# Altium schematic sheet LTE+GPS.SchDoc
size 420 x 297 mm
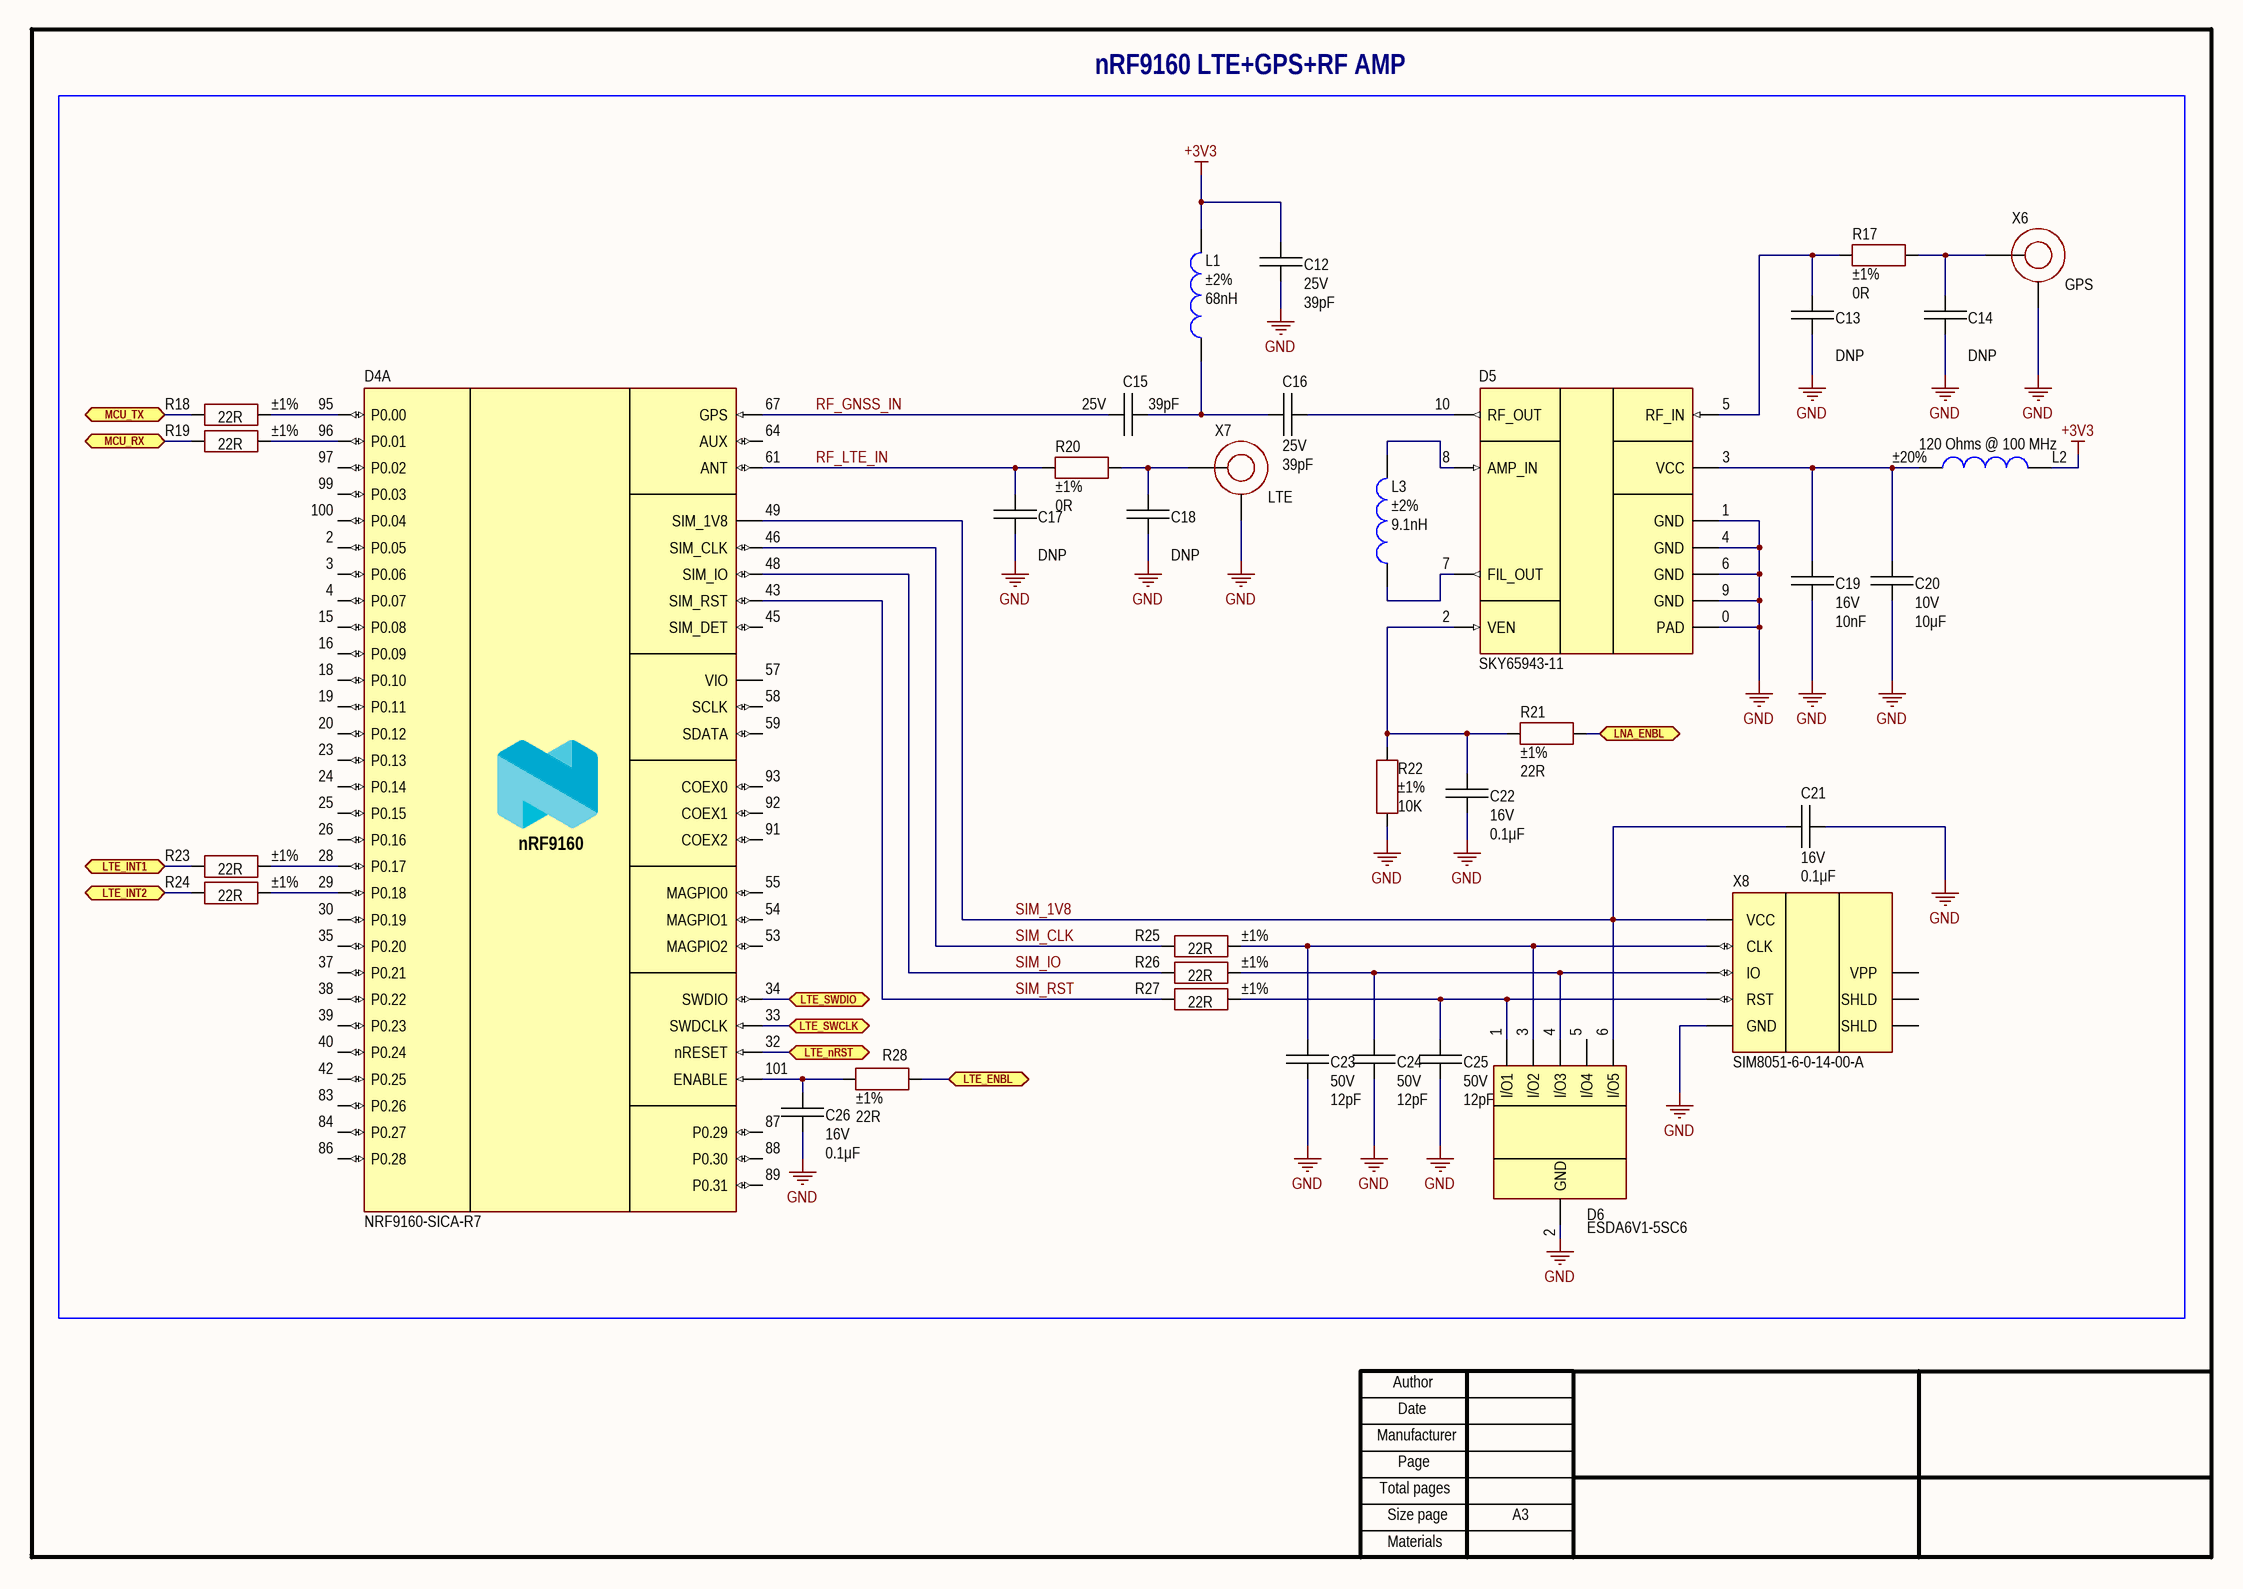
[diagram p0: LTE+GPS.SchDoc]

## Parts
C12  value 39pF  Voltage: 25V  [CAP: 0201]
C13  value DNP  [CAP: 0201]
C14  value DNP  [CAP: 0201]
C15  value 39pF  Voltage: 25V  [CAP: 0201]
C16  value 39pF  Voltage: 25V  [CAP: 0201]
C17  value DNP  [CAP: 0201]
C18  value DNP  [CAP: 0201]
C19  value 10nF  Voltage: 16V  [CAP: 0402_NO_SILK]
C20  value 10μF  Voltage: 10V  [CAP: 0805]
C21  value 0.1μF  Voltage: 16V  [CAP: 0402_NO_SILK]
C22  value 0.1μF  Voltage: 16V  [CAP: 0805]
C23  value 12pF  Voltage: 50V  [CAP: 0805]
C24  value 12pF  Voltage: 50V  [CAP: 0805]
C25  value 12pF  Voltage: 50V  [CAP: 0805]
C26  value 0.1μF  Voltage: 16V  [CAP: 0805]
D4  PartNumber: NRF9160-SICA-R7  [MOD: NRF9160]  (part A of 3)
D5  (no value)  [IC: SKY65943-11]
D6  (no value)  [SOT23-6]
L1  value 68nH  Tolerance: ±2%  [IND: 0402]
L2  value 120 Ohms @ 100 MHz  Tolerance: ±20%  [IND: 0805]
L3  value 9.1nH  Tolerance: ±2%  [IND: 0402]
R17  value 0R  Tolerance: ±1%  [RES: 0201]
R18  value 22R  Tolerance: ±1%  [RES: 0805]
R19  value 22R  Tolerance: ±1%  [RES: 0805]
R20  value 0R  Tolerance: ±1%  [RES: 0201]
R21  value 22R  Tolerance: ±1%  [RES: 0805]
R22  value 10K  Tolerance: ±1%  [RES: 0805]
R23  value 22R  Tolerance: ±1%  [RES: 0805]
R24  value 22R  Tolerance: ±1%  [RES: 0805]
R25  value 22R  Tolerance: ±1%  [RES: 0805]
R26  value 22R  Tolerance: ±1%  [RES: 0805]
R27  value 22R  Tolerance: ±1%  [RES: 0805]
R28  value 22R  Tolerance: ±1%  [RES: 0805]
X6  CommentText: GPS  [CON: u.Fl]
X7  CommentText: LTE  [CON: u.Fl]
X8  (no value)  [CON: SIM8051-6-0-14-00]

## Blocks framed on the sheet
nRF9160 LTE+GPS+RF AMP: C12-C26 D4-D6 L1-L3 R17-R28 X6-X8

## Ports
LNA_ENBL (bidir), LTE_ENBL (bidir), LTE_INT1 (bidir), LTE_INT2 (bidir), LTE_nRST (bidir), LTE_SWCLK (bidir), LTE_SWDIO (bidir), MCU_RX (bidir), MCU_TX (bidir)

## Nets
+3V3: C12.1 L1.1 L2.1
GND: C12.2 C13.1 C14.1 C17.1 C18.1 C19.1 C20.1 C21.2 C22.1 C23.1 C24.1 C25.1 C26.1 D5.0(PAD) D5.1(GND) D5.4(GND) D5.6(GND) D5.9(GND) D6.2(GND) R22.1 X6.2 X7.2 X8.C5(GND)
LNA_ENBL: R21.1 ; port LNA_ENBL
LTE_ENBL: R28.1 ; port LTE_ENBL
LTE_INT1: R23.1 ; port LTE_INT1
LTE_INT2: R24.1 ; port LTE_INT2
LTE_nRST: D4.32(nRESET) ; port LTE_nRST
LTE_SWCLK: D4.33(SWDCLK) ; port LTE_SWCLK
LTE_SWDIO: D4.34(SWDIO) ; port LTE_SWDIO
MCU_RX: R19.1 ; port MCU_RX
MCU_TX: R18.1 ; port MCU_TX
RF_GNSS_IN: C15.2 D4.67(GPS)
RF_LTE_IN: C17.2 D4.61(ANT) R20.2
SIM_1V8: C21.1 D4.49(SIM_1V8) D6.6(I/O5) X8.C1(VCC)
SIM_CLK: D4.46(SIM_CLK) R25.1
SIM_IO: D4.48(SIM_IO) R26.1
SIM_RST: D4.43(SIM_RST) R27.1
NetC13_2: C13.2 D5.5(RF_IN) R17.2
NetC14_2: C14.2 R17.1 X6.1
NetC15_1: C15.1 C16.2 L1.2
NetC16_1: C16.1 D5.10(RF_OUT)
NetC18_2: C18.2 R20.1 X7.1
NetC19_2: C19.2 C20.2 D5.3(VCC) L2.2
NetC22_2: C22.2 D5.2(VEN) R21.2 R22.2
NetC23_2: C23.2 D6.3(I/O2) R25.2 X8.C3(CLK)
NetC24_2: C24.2 D6.4(I/O3) R26.2 X8.C7(IO)
NetC25_2: C25.2 D6.1(I/O1) R27.2 X8.C2(RST)
NetC26_2: C26.2 D4.101(ENABLE) R28.2
NetD4_28: D4.28(P0.17) R23.2
NetD4_29: D4.29(P0.18) R24.2
NetD4_95: D4.95(P0.00) R18.2
NetD4_96: D4.96(P0.01) R19.2
NetD5_7: D5.7(FIL_OUT) L3.2
NetD5_8: D5.8(AMP_IN) L3.1

Not connected (* = marked no-connect by the designer): D4 2(P0.05) 3(P0.06) 4(P0.07) 15(P0.08) 16(P0.09) 18(P0.10) 19(P0.11) 20(P0.12) 23(P0.13) 24(P0.14) 25(P0.15) 26(P0.16) 30(P0.19) 35(P0.20) 37(P0.21) 38(P0.22) 39(P0.23) 40(P0.24) 42(P0.25) 45(SIM_DET) 53(MAGPIO2) 54(MAGPIO1) 55(MAGPIO0) 57(VIO) 58(SCLK) 59(SDATA) 64(AUX) 83(P0.26) 84(P0.27) 86(P0.28) 87(P0.29) 88(P0.30) 89(P0.31) 91(COEX2) 92(COEX1) 93(COEX0) 97(P0.02) 99(P0.03) 100(P0.04); D6 5(I/O4); X8 C4(SHLD) C6(VPP) C8(SHLD)

## Notes on the sheet
- Author
- Manufacturer
- Date
- Page
- Total pages
- Size page
- A3
- Materials

## Library data of the parts
C12 C15 C16 = Ceramic_0201: 39 pF ±5% 25V Ceramic Capacitor C0G, NP0 0201 (0603 Metric); Manufacturer: Murata Electronics; PartNumber: GRM0335C1E390JA01D; ValueManufacturerPartNumber: Ceramic capacitor, 39pF, NP0, ±5%, 25V, 0201, -55...+125°C; Package: 0201; HelpURL: https://www.digikey.com/en/products/detail/murata-electronics/GRM0335C1E390JA01D/4358216; Temperature: -55...+125°C; TypeCapacitor: Ceramic capacitor; Tolerance: ±5%; TypeDielectric: NP0
C13 C14 C17 C18 = Ceramic_0201: DNP; ValueManufacturerPartNumber: Ceramic capacitor, DNP, , , , 0201, -55...+125°C; TypeCapacitor: Ceramic capacitor; Package: 0201; Temperature: -55...+125°C
C19 = Ceramic_0402: 0.1 µF ±10% 16V Ceramic Capacitor X7R 0402 (1005 Metric); Manufacturer: Yageo; PartNumber: CC0805JKNPO7BN103; ValueManufacturerPartNumber: Ceramic capacitor, 10nF, X7R, ±10%, 16V, 0402, -55...+125°C; Package: 0402; HelpURL: https://www.digikey.com/en/products/detail/yageo/CC0805JKNPO7BN103/5884010; Temperature: -55...+125°C; TypeCapacitor: Ceramic capacitor; Tolerance: ±10%; TypeDielectric: X7R
C20 = Ceramic_0805: 10 µF ±10% 10V Ceramic Capacitor X7R 0805 (2012 Metric); Manufacturer: Yageo; PartNumber: CC0805KFX7R6BB106; ValueManufacturerPartNumber: Ceramic capacitor, 10μF, X7R, ±10%, 10V, 0805, -55...+125°C; Package: 0805; HelpURL: https://www.digikey.com/en/products/detail/yageo/CC0805KFX7R6BB106/11611326; Temperature: -55...+125°C; TypeCapacitor: Ceramic capacitor; Tolerance: ±10%; TypeDielectric: X7R
C21 = Ceramic_0402: 0.1 µF ±10% 16V Ceramic Capacitor X7R 0402 (1005 Metric); Manufacturer: Yageo; PartNumber: CC0402KRX7R7BB104; ValueManufacturerPartNumber: Ceramic capacitor, 0.1μF, X7R, ±10%, 16V, 0402, -55...+125°C; Package: 0402; HelpURL: https://www.digikey.com/product-detail/en/yageo/CC0402KRX7R7BB104/311-1338-1-ND/2103122; Temperature: -55...+125°C; TypeCapacitor: Ceramic capacitor; Tolerance: ±10%; TypeDielectric: X7R
C22 C26 = Ceramic_0805: Manufacturer: Yageo; PartNumber: CC0805KRX7R7BB104; ValueManufacturerPartNumber: Ceramic capacitor, 0.1μF, X7R, ±10%, 16V, 0805, -55...+125°C; TypeCapacitor: Ceramic capacitor; Tolerance: ±10%; TypeDielectric: X7R; Package: 0805; HelpURL: https://www.digikey.com/product-detail/en/yageo/CC0805KRX7R7BB104/311-1142-1-ND/303052; Temperature: -55...+125°C
C23-C25 = Ceramic_0805: 12 pF ±1% 50V Ceramic Capacitor C0G, NP0 0805 (2012 Metric); Manufacturer: Yageo; PartNumber: CC0805FRNPO9BN120; ValueManufacturerPartNumber: Ceramic capacitor, 12pF, NP0, ±10%, 50V, 0805, -55...+125°C; Tolerance: ±10%; Package: 0805; HelpURL: https://www.digikey.com/en/products/detail/yageo/CC0805FRNPO9BN120/5883925; Temperature: -55...+125°C; TypeCapacitor: Ceramic capacitor; TypeDielectric: NP0
D4 = nRF9160: LTE/GSM module; Manufacturer: Nordic Semiconductor; Supply: 3...5.5V; Frequency: 2.4GHz; TypeProtocol: LTE-M/NB-IoT/GPS; HelpURL: https://www.digikey.com/en/products/detail/nordic-semiconductor-asa/NRF9160-SICA-R7/10242085; Package: 127-LGA; ComponentType: LTE/GSM module; ValueManufacturerPartNumber: =ComponentType+', '+TypeProtocol+', '+Frequency+', '+CoreSize+', '+CoreProcessor+', '+MemoryROM+', '+MemoryRAM+', '+Supply+', '+Temperature+', '+Package; Temperature: -40...+85°C
D5 = SKY65943-11: RF front-end; Manufacturer: Skyworks Solutions; ValueManufacturerPartNumber: IC RF amplifier, 2.7 GHz, 19dB, -40...+125°C, 10-SMD Module; Gain: 19dB; Frequency: 2.7 GHz; HelpURL: https://www.digikey.com/en/products/detail/skyworks-solutions-inc/SKY65943-11/9603434; Package: 10-SMD Module; ComponentType: IC RF amplifier; Temperature: -40...+125°C; PartNumber: SKY65943-11
D6 = ESDA6V1-5SC6: TVS Array; Manufacturer: STMicroelectronics; Current: 5A peak; VoltageDrop: 6.1V; Package: SOT-23-6; HelpURL: https://www.digikey.com/en/products/detail/stmicroelectronics/ESDA6V1-5SC6/1037983; ValueManufacturerPartNumber: =TypeDiode+', '+Voltage+', '+Current+', '+VoltageDrop+', '+RecoveryTime+', '+Package+', '+Temperature; Temperature: -40...+125°C; TypeDiode: TVS array; PartNumber: ESDA6V1-5SC6
L1 = Inductor_0402: 68 nH Unshielded Wirewound Inductor 320 mA 1.1Ohm Max 0402 (1005 Metric); Manufacturer: Murata Electronics; PartNumber: LQW15AN68NG80D; ValueManufacturerPartNumber: Fixed inductor, 68nH, ±2%, 0402, 0.32A, -55...+125°C; TypeInductor: Fixed inductor; MaxCurrent: 0.32A; Package: 0402; HelpURL: https://www.digikey.com/en/products/detail/murata-electronics/LQW15AN68NG80D/4864887; Temperature: -55...+125°C
L2 = Inductor_0805: 120 Ohms @ 100 MHz 1 Power Line Ferrite Bead 0805 (2012 Metric) 3A 30mOhm; Manufacturer: Murata Electronics; PartNumber: BLM21PG121SH1D; ValueManufacturerPartNumber: Fixed inductor, 120 Ohms @ 100 MHz, ±20%, 0805, 3A, -55...+125°C; TypeInductor: Fixed inductor; Package: 0805; HelpURL: https://www.digikey.com/en/products/detail/murata-electronics/BLM21PG121SH1D/4419690; Temperature: -55...+125°C; MaxCurrent: 3A
L3 = Inductor_0402: 9.1 nH Unshielded Wirewound Inductor 1.4 A 80mOhm Max 0402 (1005 Metric); Manufacturer: Murata Electronics; PartNumber: LQW15AN9N1G8ZD; ValueManufacturerPartNumber: Fixed inductor, 9.1nH, ±2%, 0402, 1.4A, -55...+125°C; TypeInductor: Fixed inductor; MaxCurrent: 1.4A; Package: 0402; HelpURL: https://www.digikey.com/en/products/detail/murata-electronics/LQW15AN9N1G8ZD/6799034; Temperature: -55...+125°C
R17 R20 = Resistor_0201: 0 Ohms Jumper 0.05W, 1/20W Chip Resistor 0201 (0603 Metric) Moisture Resistant Thick Film; Manufacturer: Yageo; PartNumber: RC0201FR-070RL; ValueManufacturerPartNumber: Resistor film, 0R, ±1%, 0201, 0.05W, -55...+125°C; TypeResistor: Resistor film; Package: 0201; HelpURL: https://www.digikey.com/en/products/detail/yageo/RC0201FR-070RL/1948858; Temperature: -55...+125°C; Power: 0.05W
R18 R19 R21 R23-R28 = Resistor_0805: 22 Ohms ±1% 0.125W, 1/8W Chip Resistor 0805 (2012 Metric) Moisture Resistant Thick Film; Manufacturer: Yageo; PartNumber: RC0805FR-0722RL; ValueManufacturerPartNumber: Resistor film, 22R, ±1%, 0805, 0.125W, -55...+125°C; TypeResistor: Resistor film; Package: 0805; HelpURL: https://www.digikey.com/en/products/detail/yageo/RC0805FR-0722RL/727735; Temperature: -55...+125°C; Power: 0.125W
R22 = Resistor_0805: 10 kOhms ±1% 0.125W, 1/8W Chip Resistor 0805 (2012 Metric) Moisture Resistant Thick Film; Manufacturer: Yageo; PartNumber: RC0805FR-0710KL; ValueManufacturerPartNumber: Resistor film, 10K, ±1%, 0805, 0.125W, -55...+125°C; TypeResistor: Resistor film; Package: 0805; HelpURL: https://www.digikey.com/en/products/detail/yageo/RC0805FR-0710KL/727535; Temperature: -55...+125°C; Power: 0.125W
X6 X7 = Connector_uFL: U.FL (UMCC) Connector Receptacle, Male Pin 50Ohm Surface Mount Solder; Manufacturer: Hirose Electric; ValueManufacturerPartNumber: Connector u.FL, 50 Ohm, 6GHz; PartNumber: U.FL-R-SMT(01); TypeConnector: Connector u.FL; Frequency: 6GHz; HelpURL: https://www.digikey.com/product-detail/en/hirose-electric-co-ltd/U.FL-R-SMT-01/H9161-ND/513010; Impedance: 50 Ohm
X8 = SIM8051-6-0-14-00-A: Connector; Manufacturer: GCT; TypeConnector: Nano SIM; HelpURL: https://www.digikey.com/en/products/detail/gct/SIM8051-6-0-14-00-A/10649873; ValueManufacturerPartNumber: =TypeConnector+', '+Multichannel+', '+Pitch+', '+VoltageMax+', '+CurrentMax; PartNumber: SIM8051-6-0-14-00-A; CommentText: SIM8051-6-0-14-00-A